# Altium schematic sheet TK500_Driver.SchDoc: TK500 Driver
size A3; Author: Øystein Smith; Organization: Omega Verksted; DocumentNumber: 1; Revision: 0; SheetNumber: 1; SheetTotal: 20
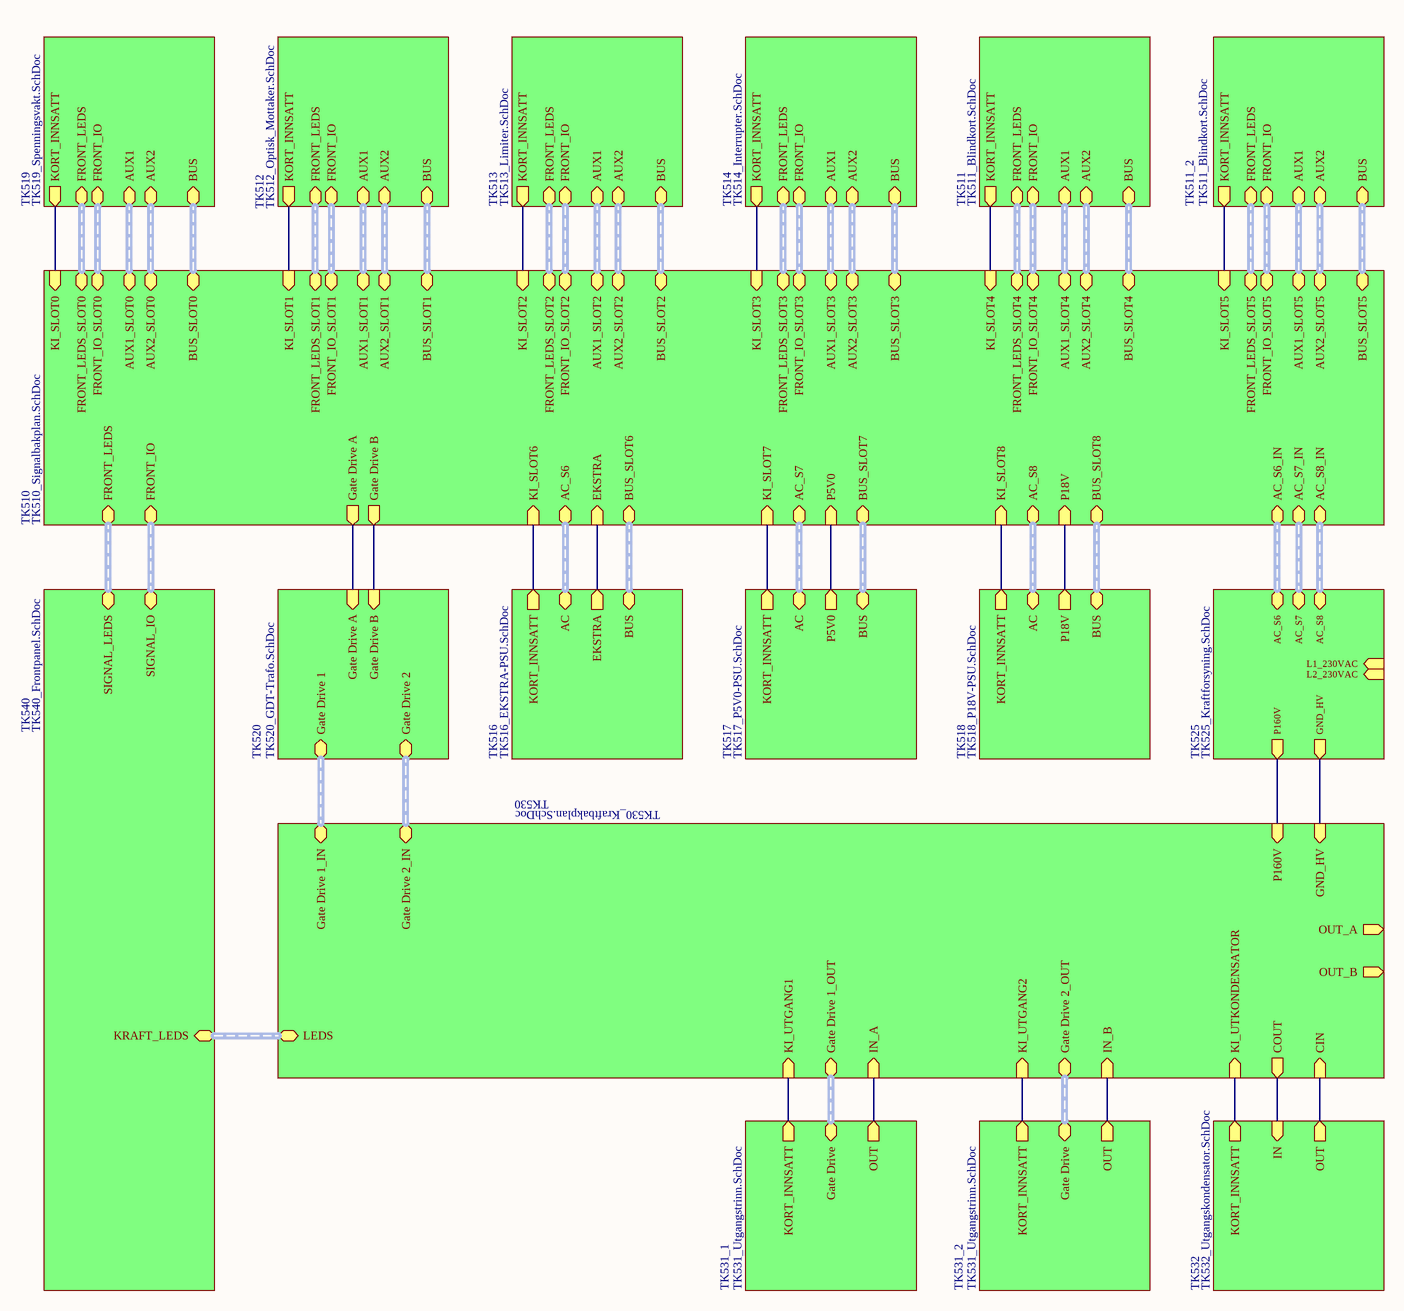
[diagram p0: TK500_Driver.SchDoc]

## Sub-sheets
TK510 = TK510_Signalbakplan.SchDoc: FRONT_LEDS_SLOT0 (harness FRONT_LEDS), AUX2_SLOT0 (harness AUX2), AUX1_SLOT0 (harness AUX1), FRONT_IO_SLOT0 (harness FRONT_IO), BUS_SLOT0 (harness BUS), FRONT_LEDS_SLOT1 (harness FRONT_LEDS), AUX2_SLOT1 (harness AUX2), AUX1_SLOT1 (harness AUX1), FRONT_IO_SLOT1 (harness FRONT_IO), BUS_SLOT1 (harness BUS), FRONT_LEDS_SLOT2 (harness FRONT_LEDS), AUX2_SLOT2 (harness AUX2), AUX1_SLOT2 (harness AUX1), FRONT_IO_SLOT2 (harness FRONT_IO), BUS_SLOT2 (harness BUS), FRONT_LEDS_SLOT3 (harness FRONT_LEDS), AUX2_SLOT3 (harness AUX2), AUX1_SLOT3 (harness AUX1), FRONT_IO_SLOT3 (harness FRONT_IO), BUS_SLOT3 (harness BUS), FRONT_LEDS_SLOT4 (harness FRONT_LEDS), AUX2_SLOT4 (harness AUX2), AUX1_SLOT4 (harness AUX1), FRONT_IO_SLOT4 (harness FRONT_IO), BUS_SLOT4 (harness BUS), FRONT_LEDS_SLOT5 (harness FRONT_LEDS), AUX2_SLOT5 (harness AUX2), AUX1_SLOT5 (harness AUX1), FRONT_IO_SLOT5 (harness FRONT_IO), BUS_SLOT5 (harness BUS), Gate Drive A (out), Gate Drive B (out), KI_SLOT0 (in), KI_SLOT1 (in), KI_SLOT2 (in), KI_SLOT3 (in), KI_SLOT4 (in), KI_SLOT5 (in), KI_SLOT7 (in), KI_SLOT8 (in), KI_SLOT6 (in), FRONT_LEDS (harness ALL_FRONT_LEDS), FRONT_IO (harness FRONT_IO), EKSTRA (in), P5V0 (in), P18V (in), AC_S6 (harness AC), AC_S7 (harness AC), AC_S8 (harness AC), BUS_SLOT6 (harness BUS), BUS_SLOT7 (harness BUS), BUS_SLOT8 (harness BUS), AC_S8_IN (harness AC), AC_S7_IN (harness AC), AC_S6_IN (harness AC)
TK511 = TK511_Blindkort.SchDoc: FRONT_LEDS (harness J51004), AUX2 (harness J51004), AUX1 (harness J51004), FRONT_IO (harness J51004), BUS (harness J51004), KORT_INNSATT (out)
TK511_2 = TK511_Blindkort.SchDoc: FRONT_LEDS (harness J51005), AUX2 (harness J51005), AUX1 (harness J51005), FRONT_IO (harness J51005), BUS (harness J51005), KORT_INNSATT (out)
TK512 = TK512_Optisk_Mottaker.SchDoc: FRONT_LEDS (harness J51001), AUX2 (harness J51001), AUX1 (harness J51001), FRONT_IO (harness J51001), BUS (harness J51001), KORT_INNSATT (out)
TK513 = TK513_Limiter.SchDoc: FRONT_LEDS (harness J51002), AUX2 (harness J51002), AUX1 (harness J51002), FRONT_IO (harness J51002), BUS (harness J51002), KORT_INNSATT (out)
TK514 = TK514_Interrupter.SchDoc: FRONT_LEDS (harness J51003), AUX2 (harness J51003), AUX1 (harness J51003), FRONT_IO (harness J51003), BUS (harness J51003), KORT_INNSATT (out)
TK516 = TK516_EKSTRA-PSU.SchDoc: KORT_INNSATT (out), EKSTRA (out), BUS (harness J51003), AC (harness AC)
TK517 = TK517_P5V0-PSU.SchDoc: KORT_INNSATT (out), P5V0 (out), BUS (harness J51003), AC (harness AC)
TK518 = TK518_P18V-PSU.SchDoc: KORT_INNSATT (out), P18V (out), BUS (harness J51003), AC (harness AC)
TK519 = TK519_Spenningsvakt.SchDoc: FRONT_LEDS (harness J51000), AUX2 (harness J51000), AUX1 (harness J51000), FRONT_IO (harness J51000), BUS (harness J51000), KORT_INNSATT (out)
TK520 = TK520_GDT-Trafo.SchDoc: Gate Drive A (in), Gate Drive B (in), Gate Drive 1 (harness Gate Drive), Gate Drive 2 (harness Gate Drive)
TK525 = TK525_Kraftforsyning.SchDoc: P160V (out), GND_HV (out), AC_S8 (harness AC), AC_S7 (harness AC), AC_S6 (harness AC), L1_230VAC (in), L2_230VAC (in)
TK530 = TK530_Kraftbakplan.SchDoc: Gate Drive 1_IN (harness Gate Drive), Gate Drive 2_IN (harness Gate Drive), Gate Drive 1_OUT (harness Gate Drive 1_OUT), Gate Drive 2_OUT (harness Gate Drive 2_OUT), OUT_A (out), OUT_B (out), IN_A (in), IN_B (in), COUT (out), CIN (in), KI_UTGANG1 (in), KI_UTGANG2 (in), KI_UTKONDENSATOR (in), P160V (in), GND_HV (in), LEDS (harness LEDS)
TK531_1 = TK531_Utgangstrinn.SchDoc: OUT (out), Gate Drive (harness Gate Drive), KORT_INNSATT (out)
TK531_2 = TK531_Utgangstrinn.SchDoc: OUT (out), Gate Drive (harness Gate Drive), KORT_INNSATT (out)
TK532 = TK532_Utgangskondensator.SchDoc: IN (in), OUT (out), KORT_INNSATT (out)
TK540 = TK540_Frontpanel.SchDoc: SIGNAL_LEDS (harness SIGNAL_LEDS), SIGNAL_IO (harness SIGNAL_IO), KRAFT_LEDS (harness KRAFT_LEDS)

## Nets
(unnamed): sheet TK510/Gate Drive A, sheet TK520/Gate Drive A
(unnamed): sheet TK510/Gate Drive B, sheet TK520/Gate Drive B
(unnamed): sheet TK510/KI_SLOT0, sheet TK519/KORT_INNSATT
(unnamed): sheet TK510/KI_SLOT1, sheet TK512/KORT_INNSATT
(unnamed): sheet TK510/KI_SLOT2, sheet TK513/KORT_INNSATT
(unnamed): sheet TK510/KI_SLOT3, sheet TK514/KORT_INNSATT
(unnamed): sheet TK510/KI_SLOT4, sheet TK511/KORT_INNSATT
(unnamed): sheet TK510/KI_SLOT5, sheet TK511_2/KORT_INNSATT
(unnamed): sheet TK510/KI_SLOT7, sheet TK517/KORT_INNSATT
(unnamed): sheet TK510/KI_SLOT8, sheet TK518/KORT_INNSATT
(unnamed): sheet TK510/KI_SLOT6, sheet TK516/KORT_INNSATT
(unnamed): sheet TK510/EKSTRA, sheet TK516/EKSTRA
(unnamed): sheet TK510/P5V0, sheet TK517/P5V0
(unnamed): sheet TK510/P18V, sheet TK518/P18V
(unnamed): sheet TK530/IN_A, sheet TK531_1/OUT
(unnamed): sheet TK530/IN_B, sheet TK531_2/OUT
(unnamed): sheet TK530/COUT, sheet TK532/IN
(unnamed): sheet TK530/CIN, sheet TK532/OUT
(unnamed): sheet TK530/KI_UTGANG1, sheet TK531_1/KORT_INNSATT
(unnamed): sheet TK530/KI_UTGANG2, sheet TK531_2/KORT_INNSATT
(unnamed): sheet TK530/KI_UTKONDENSATOR, sheet TK532/KORT_INNSATT
(unnamed): sheet TK530/P160V, sheet TK525/P160V
(unnamed): sheet TK530/GND_HV, sheet TK525/GND_HV

## Buses and harness runs
harness sheet TK510/AC_S6 = sheet TK516/AC
harness sheet TK510/AC_S6_IN = sheet TK525/AC_S6
harness sheet TK510/AC_S7 = sheet TK517/AC
harness sheet TK510/AC_S7_IN = sheet TK525/AC_S7
harness sheet TK510/AC_S8 = sheet TK518/AC
harness sheet TK510/AC_S8_IN = sheet TK525/AC_S8
harness sheet TK510/AUX1_SLOT0 = sheet TK519/AUX1
harness sheet TK510/AUX1_SLOT1 = sheet TK512/AUX1
harness sheet TK510/AUX1_SLOT2 = sheet TK513/AUX1
harness sheet TK510/AUX1_SLOT3 = sheet TK514/AUX1
harness sheet TK510/AUX1_SLOT4 = sheet TK511/AUX1
harness sheet TK510/AUX1_SLOT5 = sheet TK511_2/AUX1
harness sheet TK510/AUX2_SLOT0 = sheet TK519/AUX2
harness sheet TK510/AUX2_SLOT1 = sheet TK512/AUX2
harness sheet TK510/AUX2_SLOT2 = sheet TK513/AUX2
harness sheet TK510/AUX2_SLOT3 = sheet TK514/AUX2
harness sheet TK510/AUX2_SLOT4 = sheet TK511/AUX2
harness sheet TK510/AUX2_SLOT5 = sheet TK511_2/AUX2
harness sheet TK510/BUS_SLOT0 = sheet TK519/BUS
harness sheet TK510/BUS_SLOT1 = sheet TK512/BUS
harness sheet TK510/BUS_SLOT2 = sheet TK513/BUS
harness sheet TK510/BUS_SLOT3 = sheet TK514/BUS
harness sheet TK510/BUS_SLOT4 = sheet TK511/BUS
harness sheet TK510/BUS_SLOT5 = sheet TK511_2/BUS
harness sheet TK510/BUS_SLOT6 = sheet TK516/BUS
harness sheet TK510/BUS_SLOT7 = sheet TK517/BUS
harness sheet TK510/BUS_SLOT8 = sheet TK518/BUS
harness sheet TK510/FRONT_IO = sheet TK540/SIGNAL_IO
harness sheet TK510/FRONT_IO_SLOT0 = sheet TK519/FRONT_IO
harness sheet TK510/FRONT_IO_SLOT1 = sheet TK512/FRONT_IO
harness sheet TK510/FRONT_IO_SLOT2 = sheet TK513/FRONT_IO
harness sheet TK510/FRONT_IO_SLOT3 = sheet TK514/FRONT_IO
harness sheet TK510/FRONT_IO_SLOT4 = sheet TK511/FRONT_IO
harness sheet TK510/FRONT_IO_SLOT5 = sheet TK511_2/FRONT_IO
harness sheet TK510/FRONT_LEDS = sheet TK540/SIGNAL_LEDS
harness sheet TK510/FRONT_LEDS_SLOT0 = sheet TK519/FRONT_LEDS
harness sheet TK510/FRONT_LEDS_SLOT1 = sheet TK512/FRONT_LEDS
harness sheet TK510/FRONT_LEDS_SLOT2 = sheet TK513/FRONT_LEDS
harness sheet TK510/FRONT_LEDS_SLOT3 = sheet TK514/FRONT_LEDS
harness sheet TK510/FRONT_LEDS_SLOT4 = sheet TK511/FRONT_LEDS
harness sheet TK510/FRONT_LEDS_SLOT5 = sheet TK511_2/FRONT_LEDS
harness sheet TK520/Gate Drive 1 = sheet TK530/Gate Drive 1_IN
harness sheet TK520/Gate Drive 2 = sheet TK530/Gate Drive 2_IN
harness sheet TK530/Gate Drive 1_OUT = sheet TK531_1/Gate Drive
harness sheet TK530/Gate Drive 2_OUT = sheet TK531_2/Gate Drive
harness sheet TK530/LEDS = sheet TK540/KRAFT_LEDS

## Notes on the sheet
- Size:
- Date:
- Title:
- A3
- Revision:
- Sheet
- of
- Author:
- File: